# Altium project AVR-Tester.PrjPcb
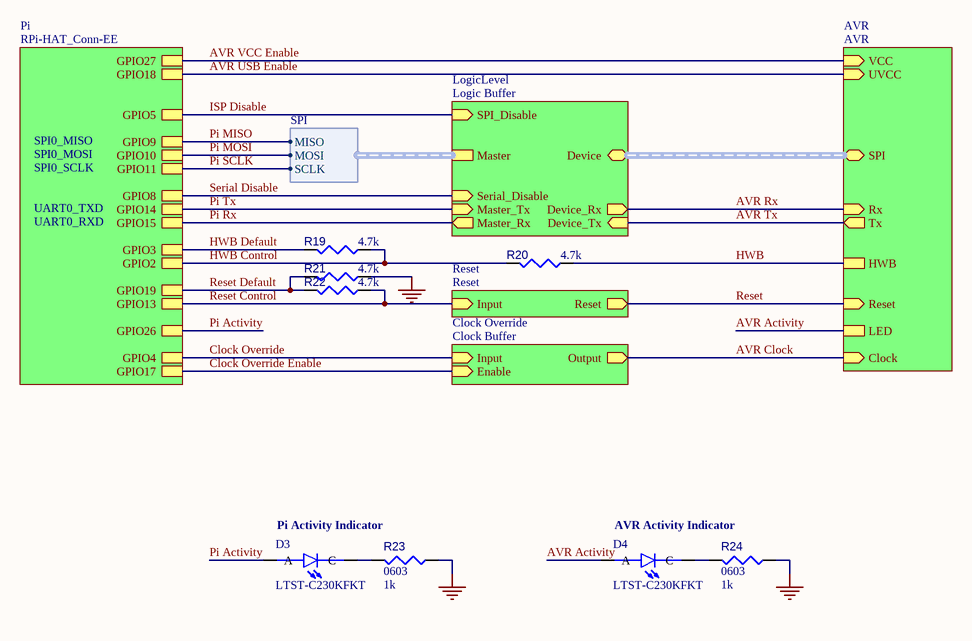
[diagram p0: Main.SchDoc]
12 sheets, 65 parts. Net scope: hierarchical (ports join the sheet entries above them; power ports are global).
Board file: AVR Test Hat.PcbDoc
Sheets:
  Main.SchDoc
    Pi = RPi-HAT_Conn-EE.SchDoc
      EEPROM = EEPROM.SchDoc
      PullUps = I2C-PullUps.SchDoc
    AVR = AVR.SchDoc
      Power = Power Switch.SchDoc
      USB = Power Switch.SchDoc
      USB = USB.SchDoc
        USB-C = USB-C.SchDoc
        PWR = USB-C.SchDoc
        micro = microUSB.SchDoc
    LogicLevel = Logic Buffer.SchDoc
    Reset = Reset.SchDoc
    Clock Override = Clock Buffer.SchDoc

## Sheet Main.SchDoc
size A; SheetNumber: 1; SheetTotal: 12

### Parts
D3  LTST-C230KFKT  [LEDC3216X110]
D4  LTST-C230KFKT  [LEDC3216X110]
R19  value 4.7k  [RESC1608X55X25ML10T15]  (hidden comment: Resistor 1k +/-1% 0603 100 mW)
R20  value 4.7k  [RESC1608X55X25ML10T15]  (hidden comment: Resistor 1k +/-1% 0603 100 mW)
R21  value 4.7k  [RESC1608X55X25ML10T15]  (hidden comment: Resistor 1k +/-1% 0603 100 mW)
R22  value 4.7k  [RESC1608X55X25ML10T15]  (hidden comment: Resistor 1k +/-1% 0603 100 mW)
R23  value 1k  Case/Package: 0603  [RESC1608X55X25ML10T15]  (hidden comment: Resistor 1k +/-1% 0603 100 mW)
R24  value 1k  Case/Package: 0603  [RESC1608X55X25ML10T15]  (hidden comment: Resistor 1k +/-1% 0603 100 mW)

### Sub-sheets
AVR = AVR: Reset (in), SPI (bidir, harness SPI), HWB, Rx (in), Tx (out), LED, VCC (in), UVCC (in), Clock (in)
Clock Override = Clock Buffer: Enable (in), Input (in), Output (out)
LogicLevel = Logic Buffer: Device (bidir, harness SPI), Device_Tx (in), Device_Rx (out), Serial_Disable (in), Master_Rx (out), Master (harness SPI), SPI_Disable (in), Master_Tx (in)
Pi = RPi-HAT_Conn-EE: GPIO5, GPIO8, GPIO14, GPIO15, GPIO19, GPIO13, GPIO26, GPIO9, GPIO10, GPIO11, GPIO3, GPIO27, GPIO18, GPIO4, GPIO17, GPIO2
Reset = Reset: Reset (out), Input (in)

### Harnesses
SPI: MISO, MOSI, SCLK

### Nets
GND: R21.1 R23.1 R24.1
AVR Activity: D4.A ; sheet AVR/LED
AVR Clock: sheet AVR/Clock, sheet Clock Override/Output
AVR Rx: sheet AVR/Rx, sheet LogicLevel/Device_Rx
AVR Tx: sheet AVR/Tx, sheet LogicLevel/Device_Tx
AVR USB Enable: sheet Pi/GPIO18, sheet AVR/UVCC
AVR VCC Enable: sheet Pi/GPIO27, sheet AVR/VCC
Clock Override: sheet Pi/GPIO4, sheet Clock Override/Input
Clock Override Enable: sheet Pi/GPIO17, sheet Clock Override/Enable
HWB: R20.1 ; sheet AVR/HWB
HWB Control: R19.1 R20.2 ; sheet Pi/GPIO2  [project net GPIO2]
HWB Default: R19.2 ; sheet Pi/GPIO3  [project net GPIO3]
ISP Disable: sheet Pi/GPIO5, sheet LogicLevel/SPI_Disable  [project net GPIO5]
Pi Activity: D3.A ; sheet Pi/GPIO26  [project net GPIO26]
Pi MISO: sheet Pi/GPIO9, sheet LogicLevel/Master.MISO  [project net GPIO9]
Pi MOSI: sheet Pi/GPIO10, sheet LogicLevel/Master.MOSI  [project net GPIO10]
Pi Rx: sheet Pi/GPIO15, sheet LogicLevel/Master_Rx  [project net GPIO15]
Pi SCLK: sheet Pi/GPIO11, sheet LogicLevel/Master.SCLK  [project net GPIO11]
Pi Tx: sheet Pi/GPIO14, sheet LogicLevel/Master_Tx  [project net GPIO14]
Reset: sheet AVR/Reset, sheet Reset/Reset
Reset Control: R22.1 ; sheet Pi/GPIO13, sheet Reset/Input  [project net GPIO13]
Reset Default: R21.2 R22.2 ; sheet Pi/GPIO19  [project net GPIO19]
Serial Disable: sheet Pi/GPIO8, sheet LogicLevel/Serial_Disable  [project net GPIO8]
NetD3_C: D3.C R23.2
NetD4_C: D4.C R24.2

### Buses and harness runs
harness sheet AVR/SPI = sheet LogicLevel/Device

### Notes on the sheet
- SPI0_MOSI
- SPI0_MISO
- SPI0_SCLK
- UART0_TXD
- UART0_RXD
- Pi Activity Indicator
- AVR Activity Indicator

### Library data of the parts
D3 D4 = CMP-010-000000-1: Orange 605nm LED Indication - Discrete 2V 1206 (3216 Metric); MF: Lite-On Inc.; Package: 1206 Lite-On; MP: LTST-C230KFKT; Pin Count: 2; Component Type: Standard; Source: LTST-C230KFKT.SchLib; Value: *; SnapEDA_Link: https://www.snapeda.com/parts/LTST-C230KFKT/Lite-On%20Inc./view-part/353318/?ref=snap; Price: None; Availability: Unavailable; Design Item ID: LTST-C230KFKT
R19-R24 = CMP-009-00014-5: Chip Resistor, 1 KOhm, +/-1%, 0.1 W, -55 to 155 degC, 0603 (1608 Metric); Voltage Rating: 50V; Power: 100mW; Tolerance: 1%; Mounting Technology: SM; Pins: 2; Min Operating Temperature: -55°C; RoHS Compliant: True; Max Operating Temperature: 155°C
  R19-R22: Case/Package: 0603

## Sheet RPi-HAT_Conn-EE.SchDoc: Raspberry Pi HAT Template
size A4; DrawnBy: Jonas Lorander; Organization: Jonas Lorander; Address1: jonas@lorander.com; Address2: Stockholm, Sweden; Address3: http://jonas.lorander.com/; DocumentNumber: -; Revision: PA1; SheetNumber: 2; SheetTotal: 12
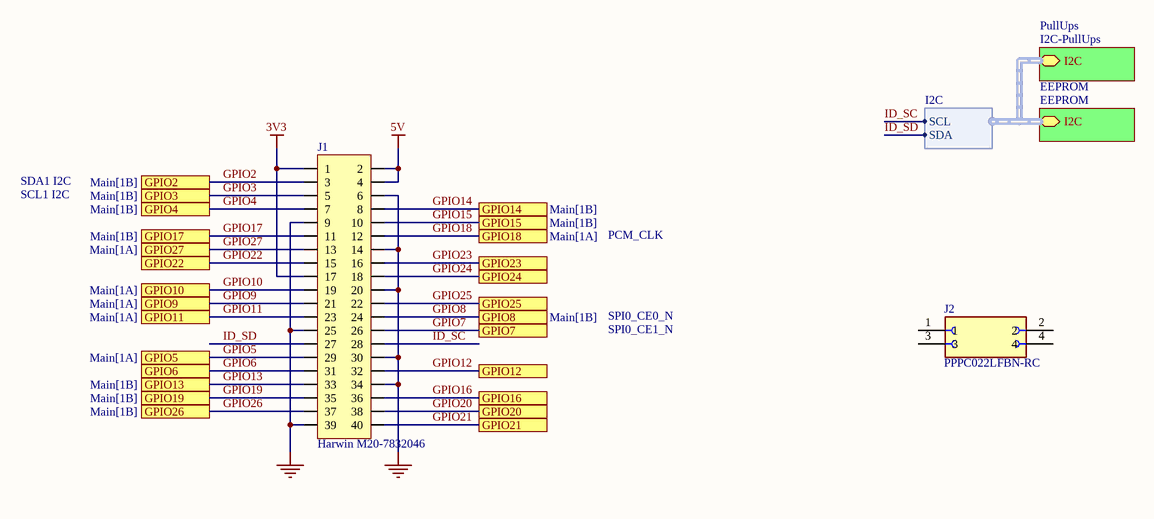
[diagram p1: RPi-HAT_Conn-EE.SchDoc]

### Parts
J1  Harwin M20-7832046  [PCB-677180-1]
J2  PPPC022LFBN-RC  [SULLINS_PPPC022LFBN-RC]

### Sub-sheets
EEPROM = EEPROM: I2C (bidir, harness I2C)
PullUps = I2C-PullUps: I2C (bidir, harness I2C)

### Ports
GPIO2 (see Main[1B]), GPIO3 (see Main[1B]), GPIO4 (see Main[1B]), GPIO5 (see Main[1A]), GPIO6, GPIO7, GPIO8 (see Main[1B]), GPIO9 (see Main[1A]), GPIO10 (see Main[1A]), GPIO11 (see Main[1A]), GPIO12, GPIO13 (see Main[1B]), GPIO14 (see Main[1B]), GPIO15 (see Main[1B]), GPIO16, GPIO17 (see Main[1B]), GPIO18 (see Main[1A]), GPIO19 (see Main[1B]), GPIO20, GPIO21, GPIO22, GPIO23, GPIO24, GPIO25, GPIO26 (see Main[1B]), GPIO27 (see Main[1A])

### Harnesses
I2C: SCL, SDA

### Nets
3V3: J1.1 J1.17
5V: J1.2 J1.4
GND: J1.6 J1.9 J1.14 J1.20 J1.25 J1.30 J1.34 J1.39
GPIO2: J1.3 ; port GPIO2
GPIO3: J1.5 ; port GPIO3
GPIO4: J1.7 ; port GPIO4  [project net Clock Override]
GPIO5: J1.29 ; port GPIO5
GPIO6: J1.31 ; port GPIO6
GPIO7: J1.26 ; port GPIO7
GPIO8: J1.24 ; port GPIO8
GPIO9: J1.21 ; port GPIO9
GPIO10: J1.19 ; port GPIO10
GPIO11: J1.23 ; port GPIO11
GPIO12: J1.32 ; port GPIO12
GPIO13: J1.33 ; port GPIO13
GPIO14: J1.8 ; port GPIO14
GPIO15: J1.10 ; port GPIO15
GPIO16: J1.36 ; port GPIO16
GPIO17: J1.11 ; port GPIO17  [project net Clock Override Enable]
GPIO18: J1.12 ; port GPIO18  [project net AVR USB Enable]
GPIO19: J1.35 ; port GPIO19
GPIO20: J1.38 ; port GPIO20
GPIO21: J1.40 ; port GPIO21
GPIO22: J1.15 ; port GPIO22
GPIO23: J1.16 ; port GPIO23
GPIO24: J1.18 ; port GPIO24
GPIO25: J1.22 ; port GPIO25
GPIO26: J1.37 ; port GPIO26
GPIO27: J1.13 ; port GPIO27  [project net AVR VCC Enable]
ID_SC: J1.28 ; sheet EEPROM/I2C.SCL
ID_SD: J1.27 ; sheet EEPROM/I2C.SDA

Not connected (* = marked no-connect by the designer): J2 1 2 3 4

### Buses and harness runs
harness sheet EEPROM/I2C = sheet PullUps/I2C

### Notes on the sheet
- SDA1 I2C
- SCL1 I2C
- PCM_CLK
- SPI0_CE0_N
- SPI0_CE1_N
- Title
- Size:
- Date:
- A4
- Number:
- Time:
- Revision:
- Sheet
- of
- File:

### Library data of the parts
J1 = CMP-2482621-3: Headers & Wire Housings 20+20 DIL VERTICAL SOCKET TIN; Contact Resistance: 0.015 Ω; Current Rating: 3.0 A; Gender: Female; Insulation Resistance: 1000000.0 Ω; Number of Contacts: 40; Number of Mating Cycles: 50; Pin Pitch: 0.00254 m; Color: Black; Contact Material: Phosphor Bronze; Contact Plating: Tin; Material: Polyester; Number of Rows: 2; Octopart Url: https://octopart.com/m20-7832046-harwin-5372736; OctopartID: 2d85e4def3a3f242; REACH SVHC Compliance: No SVHC; RoHS: Compliant
J2 = CMP-026-000000-1: 4 Position Header Connector 0.100 (2.54mm) Through Hole Gold; MF: Sullins Connector Solutions; SnapEDA_Link: https://www.snapeda.com/parts/PPPC022LFBN-RC/Sullins+Connector+Solutions/view-part/?ref=snap; Price: None; Purchase-URL: https://pricing.snapeda.com/search/part/PPPC022LFBN-RC/?ref=eda; Availability: In Stock; Pin Count: 4; Source: PPPC022LFBN-RC.SchLib; Design Item ID: PPPC022LFBN-RC; Value: *; Package: None; Component Type: Standard; Check_prices: https://www.snapeda.com/parts/PPPC022LFBN-RC/Sullins+Connector+Solutions/view-part/?ref=eda; MP: PPPC022LFBN-RC

## Sheet EEPROM.SchDoc
size A; SheetNumber: 3; SheetTotal: 12
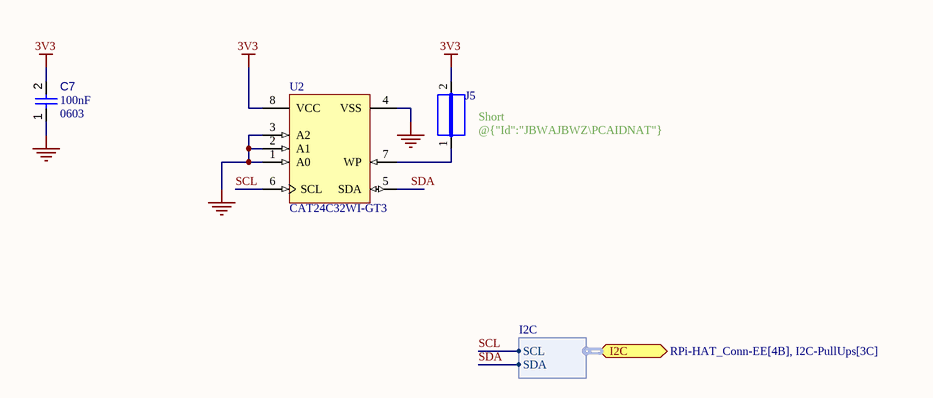
[diagram p2: EEPROM.SchDoc]

### Parts
C7  value 100nF  Case/Package: 0603  [CAPC1608X90X40NL10T20]  (hidden comment: Capacitor 100 nF +/-10% 50 V 0603)
J5  JUMPER  [JUMPER]  (value not drawn)
U2  CAT24C32WI-GT3  [ONSC-SOIC-8-751BD-01_M]

### Ports
I2C (bidir, harness I2C, see RPi-HAT_Conn-EE[4B], I2C-PullUps[3C])

### Harnesses
I2C: SCL, SDA

### Nets
3V3: C7.2 J5.2 U2.8(VCC)
GND: C7.1 U2.1(A0) U2.2(A1) U2.3(A2) U2.4(VSS)
SCL: U2.6(SCL) ; port I2C.SCL  [project net ID_SC]
SDA: U2.5(SDA) ; port I2C.SDA  [project net ID_SD]
NetJ5_1: J5.1 U2.7(WP)

### Notes on the sheet
- (near J5) Short @{"Id":"JBWAJBWZ\PCAIDNAT"} to enable
  Write Protect

### Library data of the parts
C7 = CMP-001-00017-6: Chip Capacitor, 100 nF, +/- 10%, 50 V, 0603 (1608 Metric); Voltage Rating: 50V; Capacitor Type: Ceramic; Tolerance: 10%; Mounting Technology: SM; Max Operating Temperature: 125°C; RoHS Compliant: True; Pins: 2; Min Operating Temperature: -55°C
J5 = CMP-009-00061-2: Pins: 2
U2 = CMP-019-00003-4: I2C CMOS Serial EEPROM, 32 Kb, 1.7 to 5.5 V, -40 to 85 degC, 8-Pin SOIC (751BD), RoHS, Tape and Reel; Manufacturer: ON Semiconductor; Nominal Supply Current: 2mA; Access Time: 3500ns; Clock Frequency: 100kHz; Density: 32Kb; Max Supply Voltage: 5.5V; Frequency: 400kHz; Min Supply Voltage: 1.7V; Package URL: http://www.onsemi.com/pub_link/Collateral/751BD.PDF; Max Operating Temperature: 85°C; Pins: 8; Min Operating Temperature: -40°C; Datasheet URL: http://www.onsemi.com/pub_link/Collateral/CAT24C32-D.PDF; Manufacturer URL: http://www.onsemi.com/; Interface: Serial; Datasheet Version: Rev. 24, 06/2015; RoHS Compliant: True; Max Clock Frequency: 100KHz; Mounting Technology: SM; Package Description: 8-Pin Small Outline Integrated Circuit, Body 4.9 x 3.9 mm, Pitch 1.27 mm; Case/Package: SOIC; Package Reference: SOIC-8-751BD-01; Packaging: TapeandReel; Package Quantity: 3000

## Sheet I2C-PullUps.SchDoc
size A; SheetNumber: 4; SheetTotal: 12
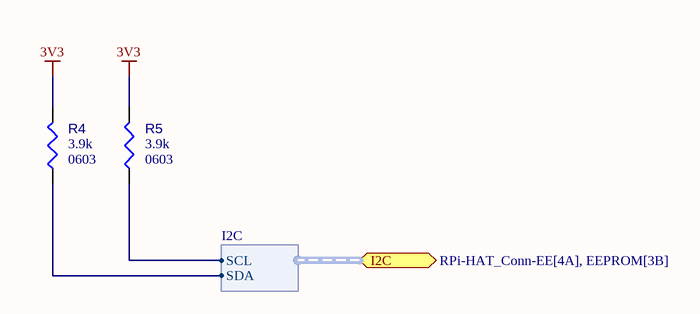
[diagram p3: I2C-PullUps.SchDoc]

### Parts
R4  value 3.9k  Case/Package: 0603  [RESC1608X55X25ML10T15]  (hidden comment: Resistor 1k +/-1% 0603 100 mW)
R5  value 3.9k  Case/Package: 0603  [RESC1608X55X25ML10T15]  (hidden comment: Resistor 1k +/-1% 0603 100 mW)

### Ports
I2C (bidir, harness I2C, see RPi-HAT_Conn-EE[4A], EEPROM[3B])

### Harnesses
I2C: SCL, SDA

### Nets
3V3: R4.2 R5.2
ID_SC: R5.1 ; port I2C.SCL
ID_SD: R4.1 ; port I2C.SDA

### Library data of the parts
R4 R5 = CMP-009-00014-5: as R19 on sheet Main; Mounting Technology: SM; Pins: 2; Min Operating Temperature: -55°C; RoHS Compliant: True; Max Operating Temperature: 155°C

## Sheet AVR.SchDoc
size A; SheetNumber: 5; SheetTotal: 12
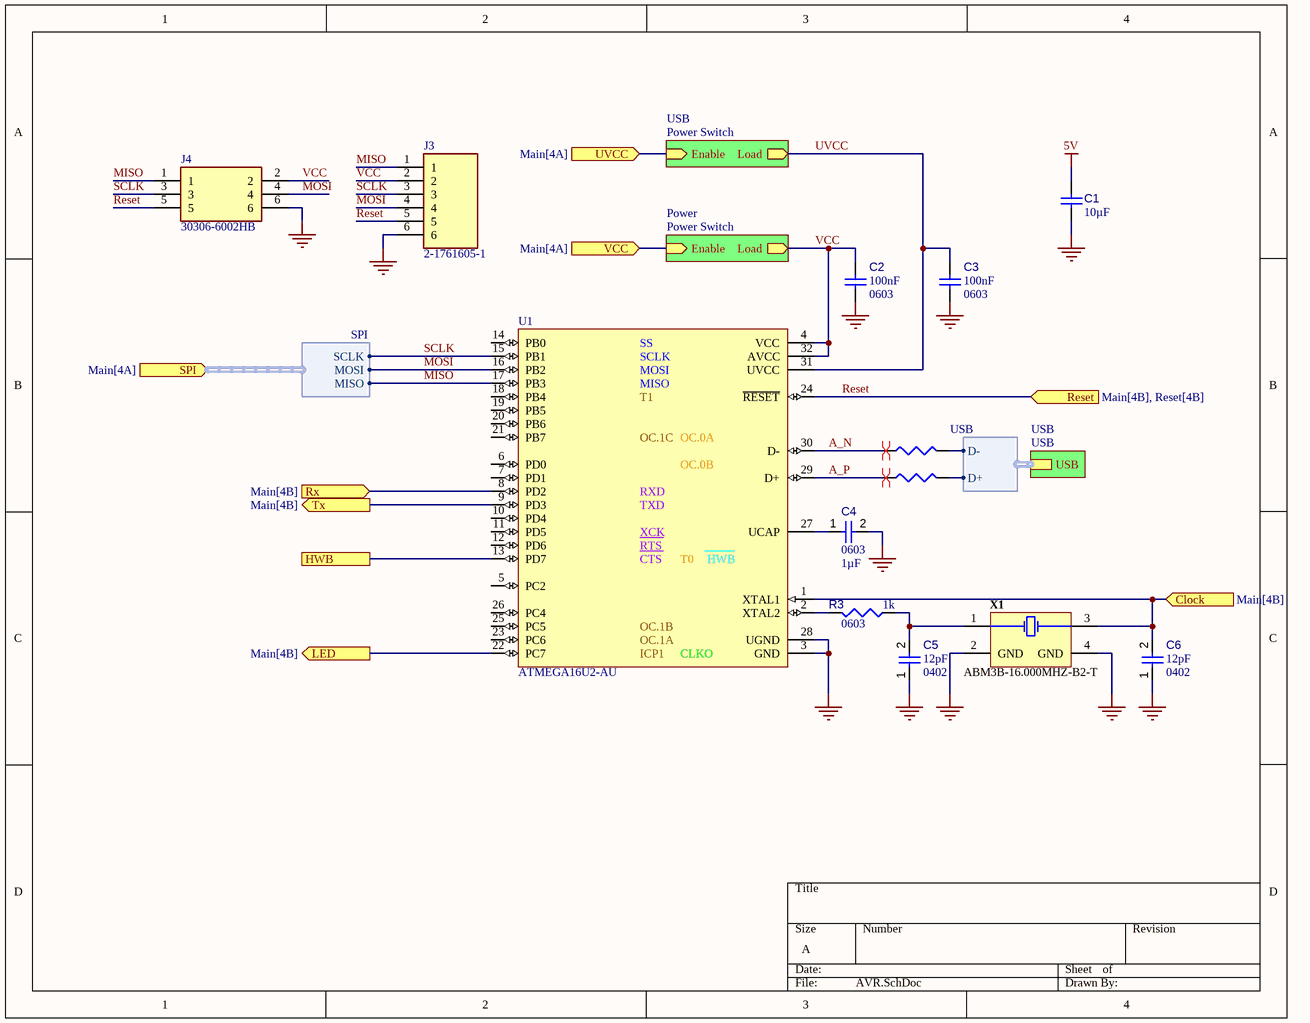
[diagram p4: AVR.SchDoc]

### Parts
C1  value 10µF  [CAPC2013X135X45NL10T25]  (hidden comment: Capacitor 10 uF +/- 10% 16 V 0805)
C2  value 100nF  Case/Package: 0603  [CAPC1608X90X40NL10T20]  (hidden comment: Capacitor 100 nF +/-10% 50 V 0603)
C3  value 100nF  Case/Package: 0603  [CAPC1608X90X40NL10T20]  (hidden comment: Capacitor 100 nF +/-10% 50 V 0603)
C4  value 1µF  Case/Package: 0603  [CAPC1608X90X35ML15T15]  (hidden comment: Capacitor 1uF +/- 10% 16V 0603)
C5  value 12pF  Case/Package: 0402  [CAPC0402(1005)33_L]  (hidden comment: Capacitor 12pF +/-10% 50V 0402)
C6  value 12pF  Case/Package: 0402  [CAPC0402(1005)33_L]  (hidden comment: Capacitor 12pF +/-10% 50V 0402)
J3  2-1761605-1  [TE_2-1761605-1]
J4  30306-6002HB  [3M_30306-6002HB]
R1  Resistor 22R +/-1% 0603 100 mW  [RESC1609X50X30ML08T20]  (value not drawn)
R2  Resistor 22R +/-1% 0603 100 mW  [RESC1609X50X30ML08T20]  (value not drawn)
R3  value 1k  Case/Package: 0603  [RESC1608X55X25ML10T15]  (hidden comment: Resistor 1k +/-1% 0603 100 mW)
U1  ATMEGA16U2-AU  [QFP80P900X900X120-32N]
X1  ABM3B-16.000MHZ-B2-T  [ABRA-ABM3B-4_V]

### Sub-sheets
Power = Power Switch: Enable (in), Load (out)
USB = Power Switch: Enable (in), Load (out)
USB = USB: USB (harness USB)

### Ports
Clock (in, see Main[4B]), HWB (see Main[4B]), LED (out, see Main[4B]), Reset (in, see Main[4B], Reset[4B]), Rx (in, see Main[4B]), SPI (in, harness SPI, see Main[4A]), Tx (out, see Main[4B]), UVCC (in, see Main[4A]), VCC (in, see Main[4A])

### Harnesses
USB: D-, D+
SPI: MISO, MOSI, SCLK

### Nets
5V: C1.1
GND: C1.2 C2.1 C3.1 C4.2 C5.1 C6.1 J3.6 J4.6 U1.3(GND) U1.28(UGND) X1.2(GND) X1.4(GND)
A_N: R1.2 U1.30(D-)
A_P: R2.2 U1.29(D+)
AVR Activity: U1.22(PC7) ; port LED
AVR Clock: C6.2 U1.1(XTAL1) X1.3(X2) ; port Clock
AVR Rx: U1.8(PD2) ; port Rx
AVR Tx: U1.9(PD3) ; port Tx
AVR USB Enable: port UVCC, sheet USB/Enable
AVR VCC Enable: port VCC, sheet Power/Enable
D_N: R1.1 ; sheet USB/USB.D-
D_P: R2.1 ; sheet USB/USB.D+
HWB: U1.13(PD7) ; port HWB
MISO: J3.1 J4.1 U1.17(PB3) ; port SPI.MISO  [project net Device_MISO]
MOSI: J3.4 J4.4 U1.16(PB2) ; port SPI.MOSI  [project net Device_MOSI]
Reset: J3.5 J4.5 U1.24(~{RESET}) ; port Reset
SCLK: J3.3 J4.3 U1.15(PB1) ; port SPI.SCLK  [project net Device_SCLK]
UVCC: C3.2 U1.31(UVCC) ; sheet USB/Load
VCC: C2.2 J3.2 J4.2 U1.4(VCC) U1.32(AVCC) ; sheet Power/Load
NetC4_1: C4.1 U1.27(UCAP)
NetC5_2: C5.2 R3.1 X1.1(X1)
NetR3_2: R3.2 U1.2(XTAL2)

Not connected (* = marked no-connect by the designer): U1 5(PC2) 6(PD0) 7(PD1) 10(PD4) 11(PD5) 12(PD6) 14(PB0) 18(PB4) 19(PB5) 20(PB6) 21(PB7) 23(PC6) 25(PC5) 26(PC4)

### Layout directives
differential pair: A_N, A_P

### Notes on the sheet
- (in symbol CMP-012-000000-3) SS; SCLK; MOSI; MISO; T1; OC.1C; OC.0A; OC.0B; RXD; TXD; XCK; ____; RTS; _____; CTS; T0; HWB; OC.1B; OC.1A; ICP1; CLKO

### Library data of the parts
C1 = CMP-001-00015-6: Chip Capacitor, 10 uF, +/- 10%, 16 V, 0805 (2012 Metric); Voltage Rating: 16V; Capacitor Type: Ceramic; RoHS Compliant: True; Max Operating Temperature: 85°C; Min Operating Temperature: -55°C; Mounting Technology: SM; Tolerance: 10%; Case/Package: 0805; Pins: 2
C2 C3 = CMP-001-00017-6: as C7 on sheet EEPROM; Tolerance: 10%; Mounting Technology: SM; Max Operating Temperature: 125°C; RoHS Compliant: True; Pins: 2; Min Operating Temperature: -55°C
C4 = CMP-001-00004-6: Chip Capacitor, 1 uF, +/- 10%, 16 V, 0603 (1608 Metric); Capacitor Type: Ceramic; Mounting Technology: SM; RoHS Compliant: True; Min Operating Temperature: -55°C; Pins: 2; Voltage Rating: 16V; Max Operating Temperature: 125°C; Tolerance: 10%
C5 C6 = CMP-001-00072-4: Chip Capacitor, 12pF +/-10%, 50V, 0402, Thickness 0.33 mm; Tolerance: 20%; Pins: 2; Max Operating Temperature: 85°C; Voltage Rating: 50V; Mounting Technology: SMT; Min Operating Temperature: -55°C
J3 = CMP-014-000000-2: Wire-To-Board Connector, AMP-LATCH Series, Through Hole, Header, 6, 2.54 mm, Gold Plated Contacts; MF: TE Connectivity; Source: SnapEDAsch.SchLib; Package: None; Price: None; Value: *; SnapEDA_Link: https://www.snapeda.com/parts/2-1761605-1/TE%20Connectivity%20AMP%20Connectors/view-part/2778412/?ref=snap; Pin Count: 6; Component Type: Standard; Design Item ID: 2-1761605-1; Availability: Unavailable; MP: 2-1761605-1
J4 = CMP-024-000000-2: Connector Header Through Hole 6 position 0.100 _2.54mm_; MF: 3M; Source: SnapEDAsch.SchLib; Design Item ID: 30306-6002HB; Pin Count: 6; Component Type: Standard; Price: None; SnapEDA_Link: https://www.snapeda.com/parts/30306-6002HB/3M%20%28TC%29/view-part/542808/?ref=snap; Availability: Unavailable; MP: 30306-6002HB; Value: *; Package: None
R1 R2 = CMP-009-00027-5: Chip Resistor, 22 Ohm, +/- 1%, 100 mW, -55 to 155 degC, 0603 (1608 Metric); Power: 100mW; Voltage Rating: 75V; Value: 22; Max Operating Temperature: 155°C; Min Operating Temperature: -55°C; Tolerance: 1%; RoHS Compliant: True; Mounting Technology: SM; Case/Package: 0603; Pins: 2
R3 = CMP-009-00014-5: as R19 on sheet Main; Mounting Technology: SM; Pins: 2; Min Operating Temperature: -55°C; RoHS Compliant: True; Max Operating Temperature: 155°C
U1 = CMP-012-000000-3: AVR AVR® ATmega Microcontroller IC 8-Bit 16MHz 16KB FLASH 32-TQFP 7x7; MF: Microchip; SnapEDA_Link: https://www.snapeda.com/parts/ATMEGA16U2-AU/Microchip/view-part/589119/?ref=snap; Value: *; MP: ATMEGA16U2-AU; Digi-Key_Purchase_URL: https://www.digikey.com.tr/product-detail/en/microchip-technology/ATMEGA16U2-AU/ATMEGA16U2-AU-ND/2050947?utm_source=snapeda&utm_medium=aggregator&utm_campaign=symbol; Package: TQFP-32 Microchip; Pin Count: 32; Digi-Key_Part_Number: ATMEGA16U2-AU-ND; Design Item ID: ATMEGA16U2-AU; Source: SnapEDAsch.SchLib; Component Type: Standard
X1 = CMP-003-00017-2: Ceramic SMD Crystal, 16 MHz, +/- 20 ppm, 18 pF, -20 to 70 degC, 4-Pin SMD, RoHS, Tape and Reel; Manufacturer: Abracon; Tolerance: 20ppm; Load Capacitance: 18pF; Frequency: 16MHz; Resistance: 50Ohm; ESR: 50; Max Operating Temperature: 70°C; Frequency Tolerance: 20ppm; Min Operating Temperature: -20°C; Packaging: TapeandReel; Manufacturer URL: http://www.abracon.com/; Package Quantity: 1000; Datasheet URL: http://www.abracon.com/Resonators/abm3b.pdf; Package Description: 4-Pin Surface Mount Device, Body 5 x 3.2 mm; Pins: 4; Package Reference: ABM3B; Datasheet Version: Aug-15; Case/Package: CSMD; Mounting Technology: SM; RoHS Compliant: True

## Sheet Power Switch.SchDoc
size A; SheetNumber: 6; SheetTotal: 12
Used 2 times, as channels AVR/Power, AVR/USB. Parts and nets are listed once, with the designators drawn on the sheet.
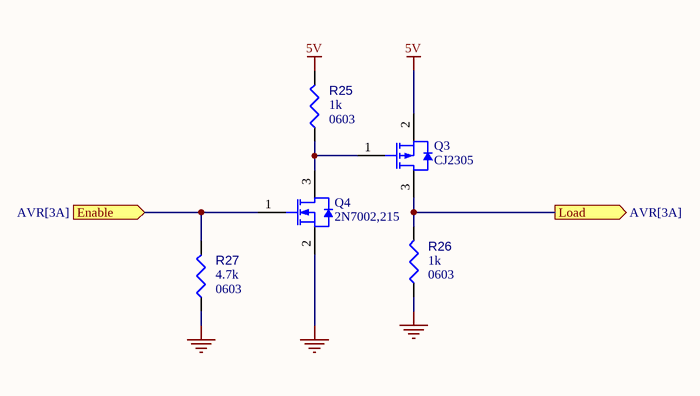
[diagram p5: Power Switch.SchDoc]

### Parts
Q3  CJ2305  [JSCJ-SOT23-3_V]
Q4  2N7002,215  [NXP-SOT23-3_V]
R25  value 1k  Case/Package: 0603  [RESC1608X55X25ML10T15]  (hidden comment: Resistor 1k +/-1% 0603 100 mW)
R26  value 1k  Case/Package: 0603  [RESC1608X55X25ML10T15]  (hidden comment: Resistor 1k +/-1% 0603 100 mW)
R27  value 4.7k  Case/Package: 0603  [RESC1608X55X25ML10T15]  (hidden comment: Resistor 1k +/-1% 0603 100 mW)

### Ports
Enable (in, see AVR[3A]), Load (out, see AVR[3A])

### Nets
5V: Q3.2(SOURCE) R25.2
GND: Q4.2(S) R26.1 R27.1
Enable: Q4.1(G) R27.2 ; port Enable
Load: Q3.3(DRAIN) R26.2 ; port Load
NetQ3_1: Q3.1(GATE) Q4.3(D) R25.1

### Channels
AVR/Power: designators end in A; ports Enable=AVR VCC Enable Load=VCC
AVR/USB: designators end in B; ports Enable=AVR USB Enable Load=UVCC

### Library data of the parts
Q3 = CMP-013-00015-3: P-Channel Plastic Encapsulate MOSFET, 12 V, 4.1 A, 3-Pin SOT23, Tape and Reel; Manufacturer: Jiangsu Changjiang Electronics Technology; Package Version: Rev. E, 09/2009; Datasheet URL: http://www.cj-elec.com/gallery/txUpfile/5140ba9ed47d18467ea4bddc055cd747.pdf; Case/Package: SOT23-3; Mounting Technology: SM; RoHS Compliant: Unknown; Datasheet Version: Rev. F, 04/2015; Package Description: 3-Pin Small Outline Transistor, Body 2.9 x 1.3 mm, Pitch 0.95 mm; Package Reference: SOT23-3
Q4 = CMP-013-00011-4: N-channel Trench MOSFET, 60 V, 300 mA, -65 to 150 degC, 3-Pin SOT-23 (TO-236AB), RoHS, Tape and Reel; Manufacturer: NXP Semiconductors; Elements: 1; Power: 830mW; Max Dual Supply Voltage: 60V; Rds On Max: 5Ohm; Package Version: Feb-16; Nominal Vgs: 2V; Input Capacitance: 50pF; RoHS Compliant: True; Datasheet URL: http://www.nxp.com/documents/data_sheet/2N7002.pdf; Packaging: TapeandReel; Case/Package: TO-236-3; Package Reference: SOT23-3; Max Operating Temperature: 150°C; Pins: 8; Mounting Technology: SM; Package Quantity: 1; Datasheet Version: Rev. 7, 09/2011; Nominal Dual Supply Voltage: 60V; Min Operating Temperature: -65°C; Package Description: 3-Pin Small Outline Transistor, Body 1.3 x 2.9 mm, Pitch 0.95 mm; Vds Max: 60V
R25-R27 = CMP-009-00014-5: as R19 on sheet Main; Mounting Technology: SM; Pins: 2; Min Operating Temperature: -55°C; RoHS Compliant: True; Max Operating Temperature: 155°C

## Sheet USB.SchDoc
size A; SheetNumber: 7; SheetTotal: 12
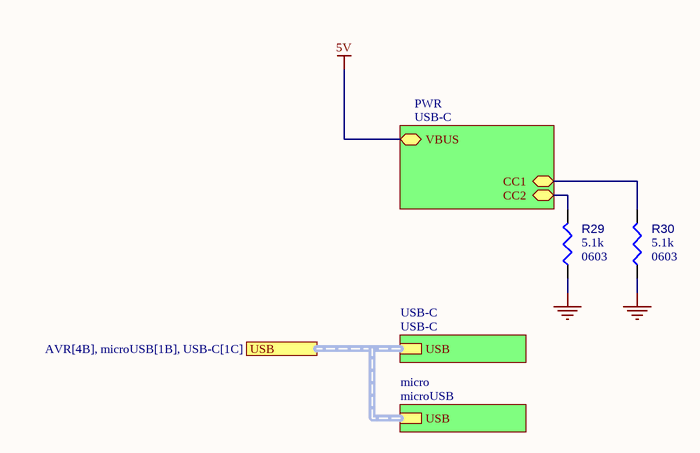
[diagram p6: USB.SchDoc]

### Parts
R29  value 5.1k  Case/Package: 0603  [RESC1608X55X25ML10T15]  (hidden comment: Resistor 1k +/-1% 0603 100 mW)
R30  value 5.1k  Case/Package: 0603  [RESC1608X55X25ML10T15]  (hidden comment: Resistor 1k +/-1% 0603 100 mW)

### Sub-sheets
micro = microUSB: USB (harness USB)
PWR = USB-C: VBUS (bidir), CC1 (bidir), CC2 (bidir)
USB-C = USB-C: USB (harness USB)

### Ports
USB (harness USB, see AVR[4B], microUSB[1B], USB-C[1C])

### Nets
GND: R29.1 R30.1
NetJ6B_A5: R30.2 ; sheet PWR/CC1
NetJ6B_B5: R29.2 ; sheet PWR/CC2

### Buses and harness runs
harness port USB = sheet micro/USB = sheet USB-C/USB

### Library data of the parts
R29 R30 = CMP-009-00014-5: as R19 on sheet Main; Mounting Technology: SM; Pins: 2; Min Operating Temperature: -55°C; RoHS Compliant: True; Max Operating Temperature: 155°C

## Sheet USB-C.SchDoc
size A; SheetNumber: 8; SheetTotal: 12
Used 2 times, as channels AVR/USB/USB-C, AVR/USB/PWR. Parts and nets are listed once, with the designators drawn on the sheet.
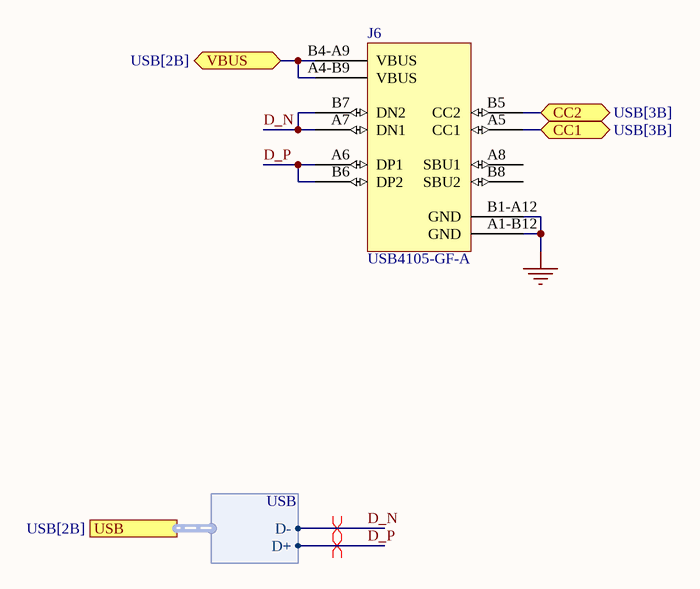
[diagram p7: USB-C.SchDoc]

### Parts
J6  USB4105-GF-A  [USB4105_GCT]

### Ports
CC1 (bidir, see USB[3B]), CC2 (bidir, see USB[3B]), USB (harness USB, see USB[2B]), VBUS (bidir, see USB[2B])

### Harnesses
USB: D-, D+

### Nets
GND: J6.A1-B12(GND) J6.B1-A12(GND)
CC1: J6.A5(CC1) ; port CC1
CC2: J6.B5(CC2) ; port CC2
D_N: J6.A7(DN1) J6.B7(DN2) ; port USB.D-
D_P: J6.A6(DP1) J6.B6(DP2) ; port USB.D+
VBUS: J6.A4-B9(VBUS) J6.B4-A9(VBUS) ; port VBUS

Not connected (* = marked no-connect by the designer): J6 A8(SBU1) B8(SBU2)

### Channels
AVR/USB/USB-C: designators end in A; ports CC1=NetJ6A_A5 CC2=NetJ6A_B5 VBUS=NetJ6A_A4-B9
AVR/USB/PWR: designators end in B; ports CC1=NetJ6B_A5 CC2=NetJ6B_B5 VBUS=5V

### Layout directives
differential pair: D_N, D_P

### Library data of the parts
J6 = CMP-022-000000-1: No Description Available; Mfr_Name: Global Connector Technology; Source: USB4105-GF-A.SchLib; Manufacturer_Part_Number: USB4105-GF-A; Design Item ID: USB4105-GF-A; Copyright: Copyright (C) 2023 Ultra Librarian. All rights reserved.; Digi-Key_Part_Number_2: 2073-USB4105-GF-ADKR-ND; Digi-Key_Part_Number_3: 2073-USB4105-GF-ATR-ND; Type: DEV; RefDes: RefDes; Digi-Key_Part_Number_1: 2073-USB4105-GF-ACT-ND

## Sheet microUSB.SchDoc
size A; SheetNumber: 9; SheetTotal: 12
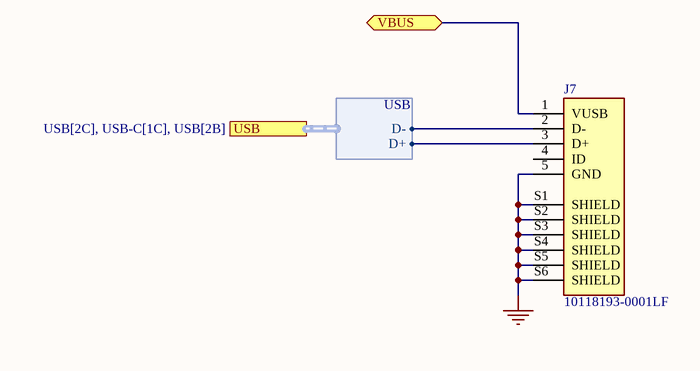
[diagram p8: microUSB.SchDoc]

### Parts
J7  10118193-0001LF  [AMPHENOL_10118193-0001LF]

### Ports
USB (harness USB, see USB[2C], USB-C[1C], USB[2B]), VBUS (bidir)

### Harnesses
USB: D-, D+

### Nets
GND: J7.5(GND) J7.S1(SHIELD) J7.S2(SHIELD) J7.S3(SHIELD) J7.S4(SHIELD) J7.S5(SHIELD) J7.S6(SHIELD)
D_N: J7.2(D-) ; port USB.D-
D_P: J7.3(D+) ; port USB.D+
NetJ7_1: J7.1(VUSB) ; port VBUS

Not connected (* = marked no-connect by the designer): J7 4(ID)

### Library data of the parts
J7 = CMP-020-000000-2: Micro USB 2.0, Input Output Connectors, B TYPE RECEPTACLE; MF: Amphenol ICC; Check_prices: https://www.snapeda.com/parts/10118193-0001LF/Amphenol+FCI/view-part/?ref=eda; Value: *; Package: None; Source: 10118193-0001LF.SchLib; Price: None; Design Item ID: 10118193-0001LF; Pin Count: 11; Availability: In Stock; SnapEDA_Link: https://www.snapeda.com/parts/10118193-0001LF/Amphenol+FCI/view-part/?ref=snap; Purchase-URL: https://pricing.snapeda.com/search/part/10118193-0001LF/?ref=eda; Component Type: Standard; MP: 10118193-0001LF

## Sheet Logic Buffer.SchDoc
size A; SheetNumber: 10; SheetTotal: 12
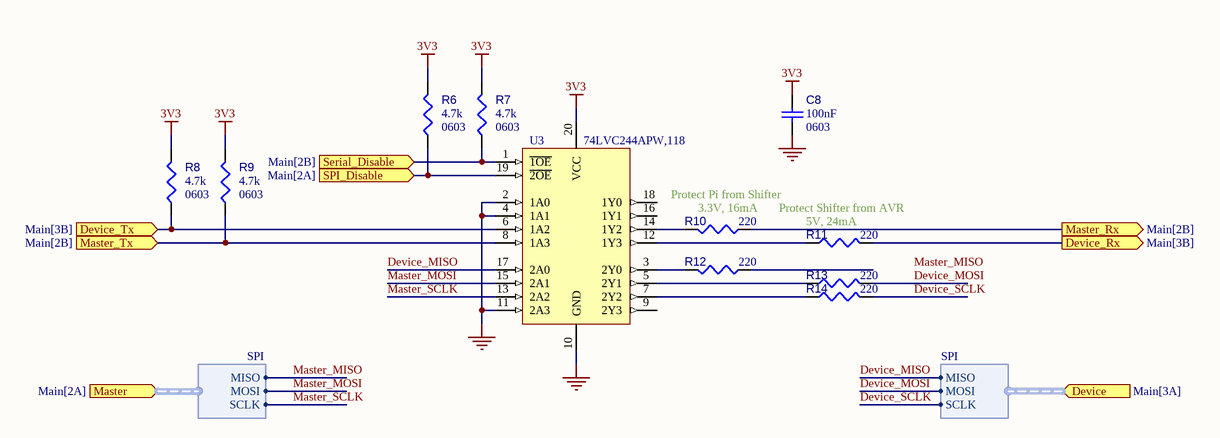
[diagram p9: Logic Buffer.SchDoc]

### Parts
C8  value 100nF  Case/Package: 0603  [CAPC1608X90X40NL10T20]  (hidden comment: Capacitor 100 nF +/-10% 50 V 0603)
R6  value 4.7k  Case/Package: 0603  [RESC1608X55X25ML10T15]  (hidden comment: Resistor 1k +/-1% 0603 100 mW)
R7  value 4.7k  Case/Package: 0603  [RESC1608X55X25ML10T15]  (hidden comment: Resistor 1k +/-1% 0603 100 mW)
R8  value 4.7k  Case/Package: 0603  [RESC1608X55X25ML10T15]  (hidden comment: Resistor 1k +/-1% 0603 100 mW)
R9  value 4.7k  Case/Package: 0603  [RESC1608X55X25ML10T15]  (hidden comment: Resistor 1k +/-1% 0603 100 mW)
R10  value 220  [RESC1608X55X25ML10T15]  (hidden comment: Resistor 1k +/-1% 0603 100 mW)
R11  value 220  [RESC0603(1608)_L]  (hidden comment: Resistor 120R +/-5 % 0603 0.1 W)
R12  value 220  [RESC1608X55X25ML10T15]  (hidden comment: Resistor 1k +/-1% 0603 100 mW)
R13  value 220  [RESC0603(1608)_L]  (hidden comment: Resistor 120R +/-5 % 0603 0.1 W)
R14  value 220  [RESC0603(1608)_L]  (hidden comment: Resistor 120R +/-5 % 0603 0.1 W)
U3  74LVC244APW,118  [SOP65P640X110-20N]

### Ports
Device (in, harness SPI, see Main[3A]), Device_Rx (out, see Main[3B]), Device_Tx (in, see Main[3B]), Master (in, harness SPI, see Main[2A]), Master_Rx (out, see Main[2B]), Master_Tx (in, see Main[2B]), Serial_Disable (in, see Main[2B]), SPI_Disable (in, see Main[2A])

### Harnesses
SPI: MISO, MOSI, SCLK

### Nets
3V3: C8.2 R6.2 R7.2 R8.2 R9.2 U3.20(VCC)
GND: C8.1 U3.2(1A0) U3.4(1A1) U3.10(GND) U3.11(2A3)
AVR Rx: R11.2 ; port Device_Rx
AVR Tx: R8.1 U3.6(1A2) ; port Device_Tx
Device_MISO: U3.17(2A0) ; port Device.MISO
Device_MOSI: R13.2 ; port Device.MOSI
Device_SCLK: R14.2 ; port Device.SCLK
GPIO5: R6.1 U3.19(~{2OE}) ; port SPI_Disable
GPIO8: R7.1 U3.1(~{1OE}) ; port Serial_Disable
GPIO14: R9.1 U3.8(1A3) ; port Master_Tx
GPIO15: R10.1 ; port Master_Rx
Master_MOSI: U3.15(2A1) ; port Master.MOSI  [project net GPIO10]
Master_SCLK: U3.13(2A2) ; port Master.SCLK  [project net GPIO11]
NetR10_2: R10.2 U3.14(1Y2)
NetR11_1: R11.1 U3.12(1Y3)
NetR12_2: R12.2 U3.3(2Y0)
NetR13_1: R13.1 U3.5(2Y1)
NetR14_1: R14.1 U3.7(2Y2)

Not connected (* = marked no-connect by the designer): R12 1; U3 9(2Y3) 16(1Y1) 18(1Y0)

### Notes on the sheet
- Protect Pi from Shifter
- (near R10) 3.3V, 16mA
- Protect Shifter from AVR
- (near R11) 5V, 24mA
- Labels drawn without touching a wire or pin: Master_MISO

### Library data of the parts
C8 = CMP-001-00017-6: as C7 on sheet EEPROM; Tolerance: 10%; Mounting Technology: SM; Max Operating Temperature: 125°C; RoHS Compliant: True; Pins: 2; Min Operating Temperature: -55°C
R6-R10 R12 = CMP-009-00014-5: as R19 on sheet Main; Mounting Technology: SM; Pins: 2; Min Operating Temperature: -55°C; RoHS Compliant: True; Max Operating Temperature: 155°C
  R10 R12: Case/Package: 0603
R11 R13 R14 = CMP-009-00176-3: Chip Resistor, 120 Ohms, +/-5 %, 0.1 W, -55 to 155 degC, 0603; Power: 100mW; Tolerance: 5%; Max Operating Temperature: 155°C; Pins: 2; Case/Package: 0603; Min Operating Temperature: -55°C
U3 = CMP-008-000000-3: Octal buffer/line driver; MP: 74LVC244APW-118; Source: 74LVC244APW,118.SchLib; Package: None; Design Item ID: 74LVC244APW,118; Value: *; Pin Count: 20; Availability: Unavailable; Price: None; Component Type: Standard

## Sheet Reset.SchDoc
size A; SheetNumber: 11; SheetTotal: 12
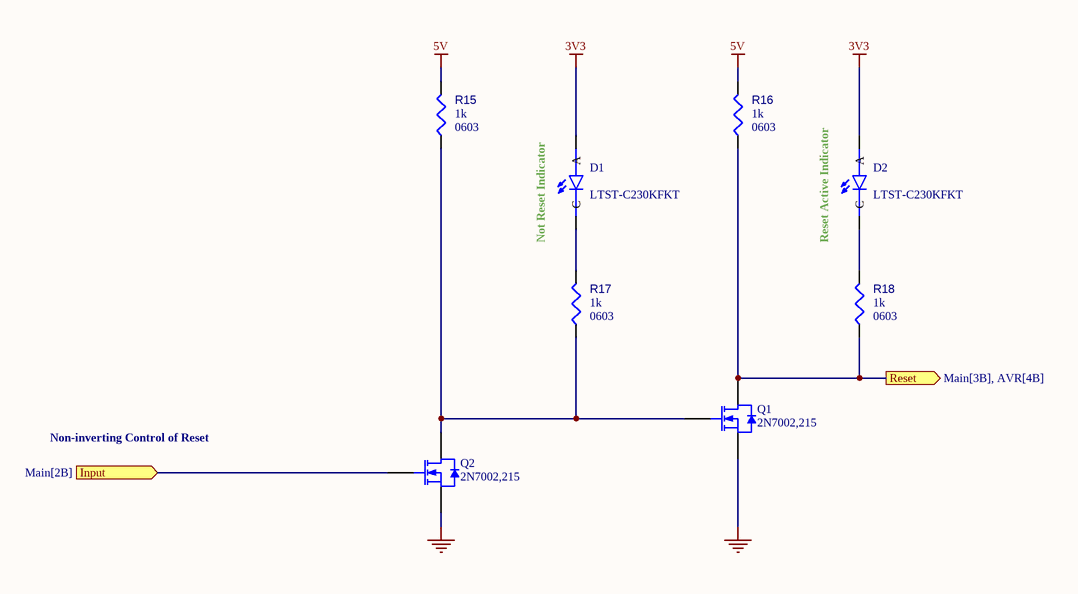
[diagram p10: Reset.SchDoc]

### Parts
D1  LTST-C230KFKT  [LEDC3216X110]
D2  LTST-C230KFKT  [LEDC3216X110]
Q1  2N7002,215  [NXP-SOT23-3_V]
Q2  2N7002,215  [NXP-SOT23-3_V]
R15  value 1k  Case/Package: 0603  [RESC1608X55X25ML10T15]  (hidden comment: Resistor 1k +/-1% 0603 100 mW)
R16  value 1k  Case/Package: 0603  [RESC1608X55X25ML10T15]  (hidden comment: Resistor 1k +/-1% 0603 100 mW)
R17  value 1k  Case/Package: 0603  [RESC1608X55X25ML10T15]  (hidden comment: Resistor 1k +/-1% 0603 100 mW)
R18  value 1k  Case/Package: 0603  [RESC1608X55X25ML10T15]  (hidden comment: Resistor 1k +/-1% 0603 100 mW)

### Ports
Input (in, see Main[2B]), Reset (out, see Main[3B], AVR[4B])

### Nets
3V3: D1.A D2.A
5V: R15.2 R16.2
GND: Q1.2(S) Q2.2(S)
GPIO13: Q2.1(G) ; port Input
Reset: Q1.3(D) R16.1 R18.1 ; port Reset
NetD1_C: D1.C R17.2
NetD2_C: D2.C R18.2
NetQ1_1: Q1.1(G) Q2.3(D) R15.1 R17.1

### Notes on the sheet
- (near D1) Not Reset Indicator
- (near D2) Reset Active Indicator
- Non-inverting Control of Reset

### Library data of the parts
D1 D2 = CMP-010-000000-1: as D3 on sheet Main; Package: 1206 Lite-On; MP: LTST-C230KFKT; Pin Count: 2; Component Type: Standard; Source: LTST-C230KFKT.SchLib; Value: *; SnapEDA_Link: https://www.snapeda.com/parts/LTST-C230KFKT/Lite-On%20Inc./view-part/353318/?ref=snap; Price: None; Availability: Unavailable; Design Item ID: LTST-C230KFKT
Q1 Q2 = CMP-013-00011-4: as Q4 on sheet Power Switch; RoHS Compliant: True; Datasheet URL: http://www.nxp.com/documents/data_sheet/2N7002.pdf; Packaging: TapeandReel; Case/Package: TO-236-3; Package Reference: SOT23-3; Max Operating Temperature: 150°C; Pins: 8; Mounting Technology: SM; Package Quantity: 1; Datasheet Version: Rev. 7, 09/2011; Nominal Dual Supply Voltage: 60V; Min Operating Temperature: -65°C; Package Description: 3-Pin Small Outline Transistor, Body 1.3 x 2.9 mm, Pitch 0.95 mm; Vds Max: 60V
R15-R18 = CMP-009-00014-5: as R19 on sheet Main; Mounting Technology: SM; Pins: 2; Min Operating Temperature: -55°C; RoHS Compliant: True; Max Operating Temperature: 155°C

## Sheet Clock Buffer.SchDoc
size A; SheetNumber: 12; SheetTotal: 12
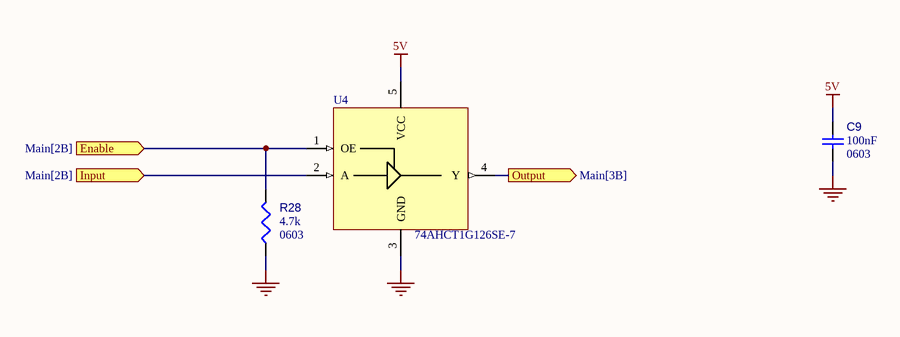
[diagram p11: Clock Buffer.SchDoc]

### Parts
C9  value 100nF  Case/Package: 0603  [CAPC1608X90X40NL10T20]  (hidden comment: Capacitor 100 nF +/-10% 50 V 0603)
R28  value 4.7k  Case/Package: 0603  [RESC1608X55X25ML10T15]  (hidden comment: Resistor 1k +/-1% 0603 100 mW)
U4  74AHCT1G126SE-7  [SOT65P210X110-5N]

### Ports
Enable (in, see Main[2B]), Input (in, see Main[2B]), Output (out, see Main[3B])

### Nets
5V: C9.2 U4.5(VCC)
GND: C9.1 R28.1 U4.3(GND)
AVR Clock: U4.4(Y) ; port Output
Clock Override: U4.2(A) ; port Input
Clock Override Enable: R28.2 U4.1(OE) ; port Enable

### Library data of the parts
C9 = CMP-001-00017-6: as C7 on sheet EEPROM; Tolerance: 10%; Mounting Technology: SM; Max Operating Temperature: 125°C; RoHS Compliant: True; Pins: 2; Min Operating Temperature: -55°C
R28 = CMP-009-00014-5: as R19 on sheet Main; Mounting Technology: SM; Pins: 2; Min Operating Temperature: -55°C; RoHS Compliant: True; Max Operating Temperature: 155°C
U4 = CMP-018-000000-2: 74AHC Series 5.5 V Surface Mount Single Buffer Gate w/ 3-ST Output - SOT-353; MF: Diodes Inc.; Value: *; Source: SnapEDAsch.SchLib; Package: SOT-353 Diodes Inc.; Design Item ID: 74AHCT1G126SE-7; Availability: Unavailable; MP: 74AHCT1G126SE-7; DigiKey-Purchase-URL: https://snapeda.com/shop?store=DigiKey&id=139076; SnapEDA_Link: https://www.snapeda.com/parts/74AHCT1G126SE-7/Diodes%20Inc./view-part/139076/?ref=snap; Component Type: Standard; Price: None; Pin Count: 5

## Nets that join several sheets
3V3: RPi-HAT_Conn-EE (J1.1 J1.17), EEPROM (C7.2 J5.2 U2.8), I2C-PullUps (R4.2 R5.2), Logic Buffer (6 pins), Reset (D1.A D2.A)
5V: RPi-HAT_Conn-EE (J1.2 J1.4), AVR (C1.1), AVR/Power (Q3A.2 R25A.2), AVR/USB (Q3B.2 R25B.2), AVR/USB/PWR (J6B.A4-B9 J6B.B4-A9), Reset (R15.2 R16.2), Clock Buffer (C9.2 U4.5)
GND: Main (R21.1 R23.1 R24.1), RPi-HAT_Conn-EE (8 pins), EEPROM (5 pins), AVR (12 pins), AVR/Power (Q4A.2 R26A.1 R27A.1), AVR/USB (Q4B.2 R26B.1 R27B.1), USB (R29.1 R30.1), AVR/USB/USB-C (J6A.A1-B12 J6A.B1-A12), AVR/USB/PWR (J6B.A1-B12 J6B.B1-A12), microUSB (7 pins), Logic Buffer (5 pins), Reset (Q1.2 Q2.2), Clock Buffer (C9.1 R28.1 U4.3)
AVR Activity: Main (D4.A), AVR (U1.22)
AVR Clock: AVR (C6.2 U1.1 X1.3), Clock Buffer (U4.4)
AVR Rx: AVR (U1.8), Logic Buffer (R11.2)
AVR Tx: AVR (U1.9), Logic Buffer (R8.1 U3.6)
AVR USB Enable: RPi-HAT_Conn-EE (J1.12), AVR/USB (Q4B.1 R27B.2)
AVR VCC Enable: RPi-HAT_Conn-EE (J1.13), AVR/Power (Q4A.1 R27A.2)
Clock Override: RPi-HAT_Conn-EE (J1.7), Clock Buffer (U4.2)
Clock Override Enable: RPi-HAT_Conn-EE (J1.11), Clock Buffer (R28.2 U4.1)
D_N: AVR (R1.1), AVR/USB/USB-C (J6A.A7 J6A.B7), microUSB (J7.2)
D_P: AVR (R2.1), AVR/USB/USB-C (J6A.A6 J6A.B6), microUSB (J7.3)
Device_MISO: AVR (J3.1 J4.1 U1.17), Logic Buffer (U3.17)
Device_MOSI: AVR (J3.4 J4.4 U1.16), Logic Buffer (R13.2)
Device_SCLK: AVR (J3.3 J4.3 U1.15), Logic Buffer (R14.2)
GPIO2: Main (R19.1 R20.2), RPi-HAT_Conn-EE (J1.3)
GPIO3: Main (R19.2), RPi-HAT_Conn-EE (J1.5)
GPIO5: RPi-HAT_Conn-EE (J1.29), Logic Buffer (R6.1 U3.19)
GPIO8: RPi-HAT_Conn-EE (J1.24), Logic Buffer (R7.1 U3.1)
GPIO10: RPi-HAT_Conn-EE (J1.19), Logic Buffer (U3.15)
GPIO11: RPi-HAT_Conn-EE (J1.23), Logic Buffer (U3.13)
GPIO13: Main (R22.1), RPi-HAT_Conn-EE (J1.33), Reset (Q2.1)
GPIO14: RPi-HAT_Conn-EE (J1.8), Logic Buffer (R9.1 U3.8)
GPIO15: RPi-HAT_Conn-EE (J1.10), Logic Buffer (R10.1)
GPIO19: Main (R21.2 R22.2), RPi-HAT_Conn-EE (J1.35)
GPIO26: Main (D3.A), RPi-HAT_Conn-EE (J1.37)
HWB: Main (R20.1), AVR (U1.13)
ID_SC: RPi-HAT_Conn-EE (J1.28), EEPROM (U2.6), I2C-PullUps (R5.1)
ID_SD: RPi-HAT_Conn-EE (J1.27), EEPROM (U2.5), I2C-PullUps (R4.1)
NetJ6B_A5: USB (R30.2), AVR/USB/PWR (J6B.A5)
NetJ6B_B5: USB (R29.2), AVR/USB/PWR (J6B.B5)
Reset: AVR (J3.5 J4.5 U1.24), Reset (Q1.3 R16.1 R18.1)
UVCC: AVR (C3.2 U1.31), AVR/USB (Q3B.3 R26B.2)
VCC: AVR (5 pins), AVR/Power (Q3A.3 R26A.2)